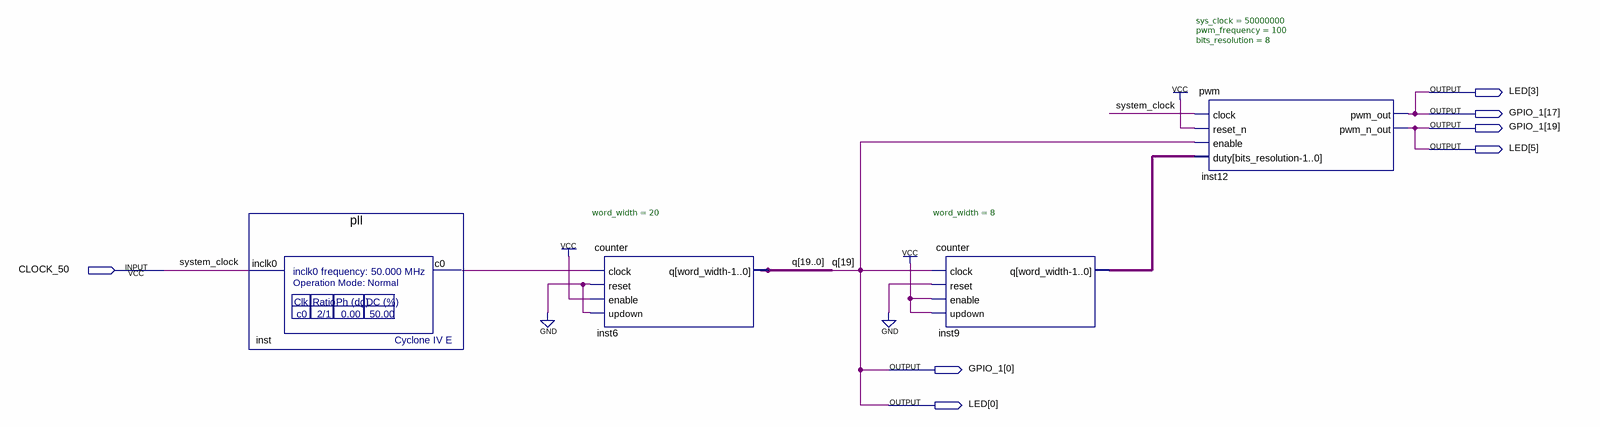
[diagram p0: schematic sheet]
// Quartus schematic tp5.bdf as structural Verilog: 4 symbols, 7 pins
module tp5 (
  input  CLOCK_50,
  output [5:0] LED,
  output [19:0] GPIO_1
);

  wire inst_c0;
  wire [7:0] inst9_q;
  wire [18:0] q;

  pll inst (.inclk0(CLOCK_50), .c0(inst_c0));
  counter #(.word_width(20)) inst6 (.clock(inst_c0), .reset(1'b0), .enable(1'b1), .updown(1'b0), .q({GPIO_1[0], q}));
  counter #(.word_width(8)) inst9 (.clock(GPIO_1[0]), .reset(1'b0), .enable(1'b1), .updown(1'b1), .q(inst9_q));
  pwm #(.sys_clock(50000000), .pwm_frequency(100), .bits_resolution(8)) inst12 (
    .clock(CLOCK_50), .reset_n(1'b1), .enable(GPIO_1[0]), .duty(inst9_q), .pwm_out(GPIO_1[17]),
    .pwm_n_out(GPIO_1[19]));

  assign {LED[5], LED[3], LED[0]} = {GPIO_1[19], GPIO_1[17], GPIO_1[0]};

  // Other names for the same wires on the sheet: q[19] = GPIO_1[0]; system_clock = CLOCK_50
endmodule
